# EAGLE design integrator (EAGLE 7.2.0)
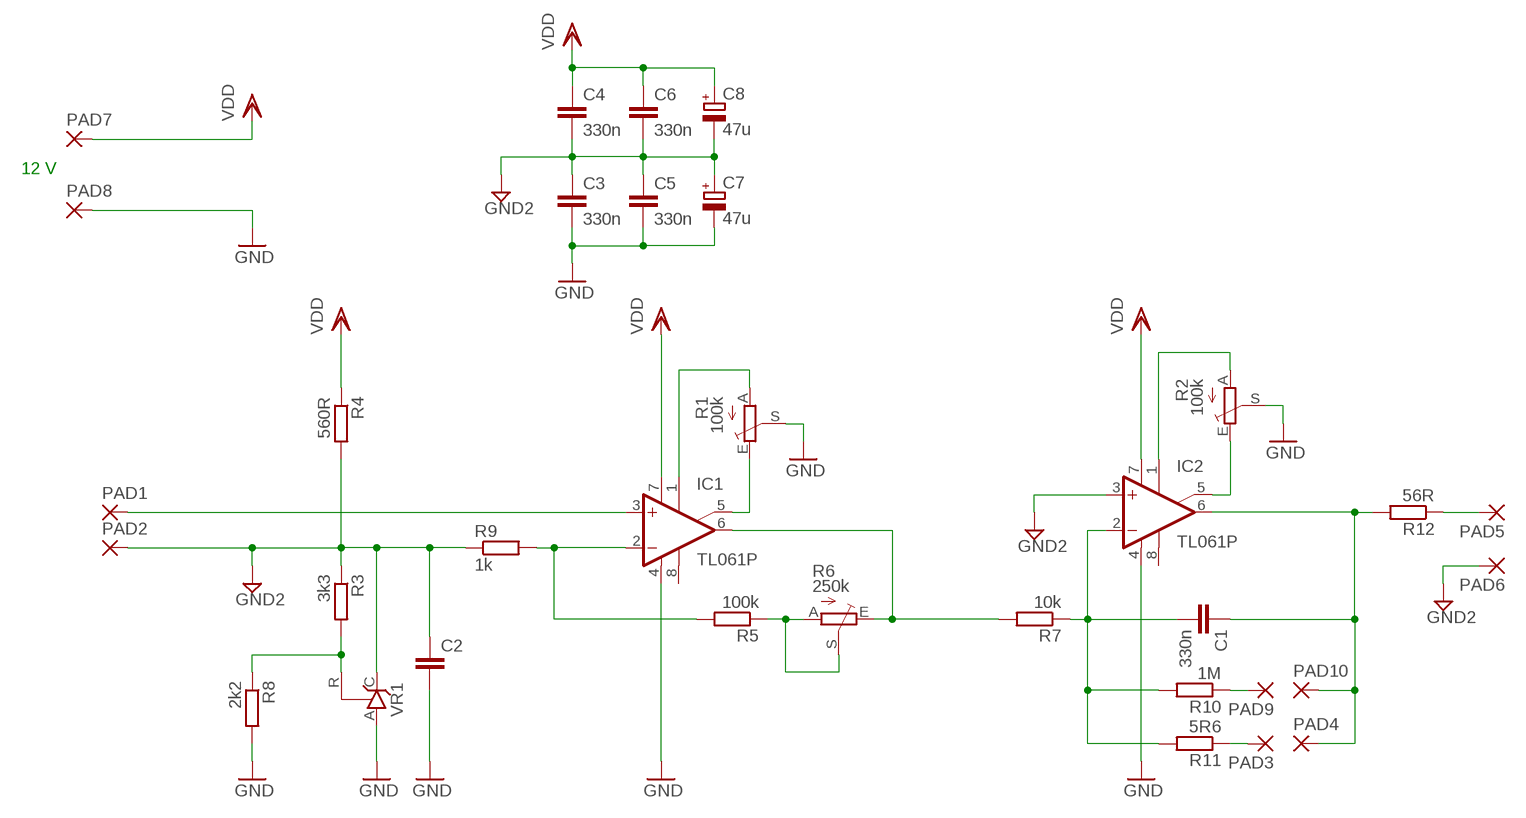
[diagram p0: schematic, sheet 1]

## Parts
C1  330n  C-EU050-035X075  [C050-035X075]
C2  C-EU050-035X075  [C050-035X075]
C3  330n  C-EU050-035X075  [C050-035X075]
C4  330n  C-EU050-035X075  [C050-035X075]
C5  330n  C-EU050-035X075  [C050-035X075]
C6  330n  C-EU050-035X075  [C050-035X075]
C7  47u  CPOL-EUE2.5-7  [E2,5-7]
C8  47u  CPOL-EUE2.5-7  [E2,5-7]
IC1  TL061P  [DIL08]
IC2  TL061P  [DIL08]
PAD1  3,81/1,4  [3,81/1,4]
PAD2  3,81/1,4  [3,81/1,4]
PAD3  3,81/1,4  [3,81/1,4]
PAD4  3,81/1,4  [3,81/1,4]
PAD5  3,81/1,4  [3,81/1,4]
PAD6  3,81/1,4  [3,81/1,4]
PAD7  3,81/1,4  [3,81/1,4]
PAD8  3,81/1,4  [3,81/1,4]
PAD9  3,81/1,4  [3,81/1,4]
PAD10  3,81/1,4  [3,81/1,4]
R1  100k  TRIM_EU-LI10  [LI10]
R2  100k  TRIM_EU-LI10  [LI10]
R3  3k3  R-EU_0207/12  [0207/12]
R4  560R  R-EU_0207/12  [0207/12]
R5  100k  R-EU_0207/12  [0207/12]
R6  250k  TRIM_EU-LI10  [LI10]
R7  10k  R-EU_0207/12  [0207/12]
R8  2k2  R-EU_0207/12  [0207/12]
R9  1k  R-EU_0207/12  [0207/12]
R10  1M  R-EU_0207/12  [0207/12]
R11  5R6  R-EU_0207/12  [0207/12]
R12  56R  R-EU_0207/12  [0207/12]
VR1  TL431CLP  [TO92-CLP]

## Nets
GND: C2.2 C3.2 C5.2 C7.- IC1.4(V-) IC2.4(V-) PAD8.1(P) R1.S R2.S R8.2 VR1.A
GND2: C2.1 C3.1 C4.2 C5.1 C6.2 C7.+ C8.- IC2.3(+IN) PAD2.1(P) PAD6.1(P) R3.1 R4.2 R9.1 VR1.C
N$1: IC1.5(ON2) R1.E
N$2: IC1.1(ON1) R1.A
N$3: IC2.5(ON2) R2.E
N$4: IC2.1(ON1) R2.A
N$5: IC1.2(-IN) R5.2 R9.2
N$6: R5.1 R6.A R6.S
N$7: IC1.6(OUT) R6.E R7.2
N$8: C1.2 IC2.2(-IN) R7.1 R10.2 R11.2
N$10: R3.2 R8.1 VR1.R
N$11: PAD9.1(P) R10.1
N$14: IC1.3(+IN) PAD1.1(P)
N$15: PAD3.1(P) R11.1
N$16: PAD5.1(P) R12.1
OUT: C1.1 IC2.6(OUT) PAD4.1(P) PAD10.1(P) R12.2
VDD: C4.1 C6.1 C8.+ IC1.7(V+) IC2.7(V+) PAD7.1(P) R4.1
Unconnected: IC1.8(OPT) IC2.8(OPT)

## Notes on the sheet
- 12 V

## Library data of the parts
C1-C6 = rcl:C-EU: CAPACITOR, European symbol
C7 C8 = rcl:CPOL-EU: POLARIZED CAPACITOR, European symbol
IC1 IC2 = linear:TL061: OP AMP
PAD1-PAD10 = wirepad:3,81/1,4: THROUGH-HOLE PAD
R1 R2 R6 = pot:TRIM_EU-: POTENTIOMETER
R3-R5 R7-R12 = rcl:R-EU_: RESISTOR, European symbol
VR1 = v-reg:TL431CLP: VOLTAGE REGULATOR

## Board
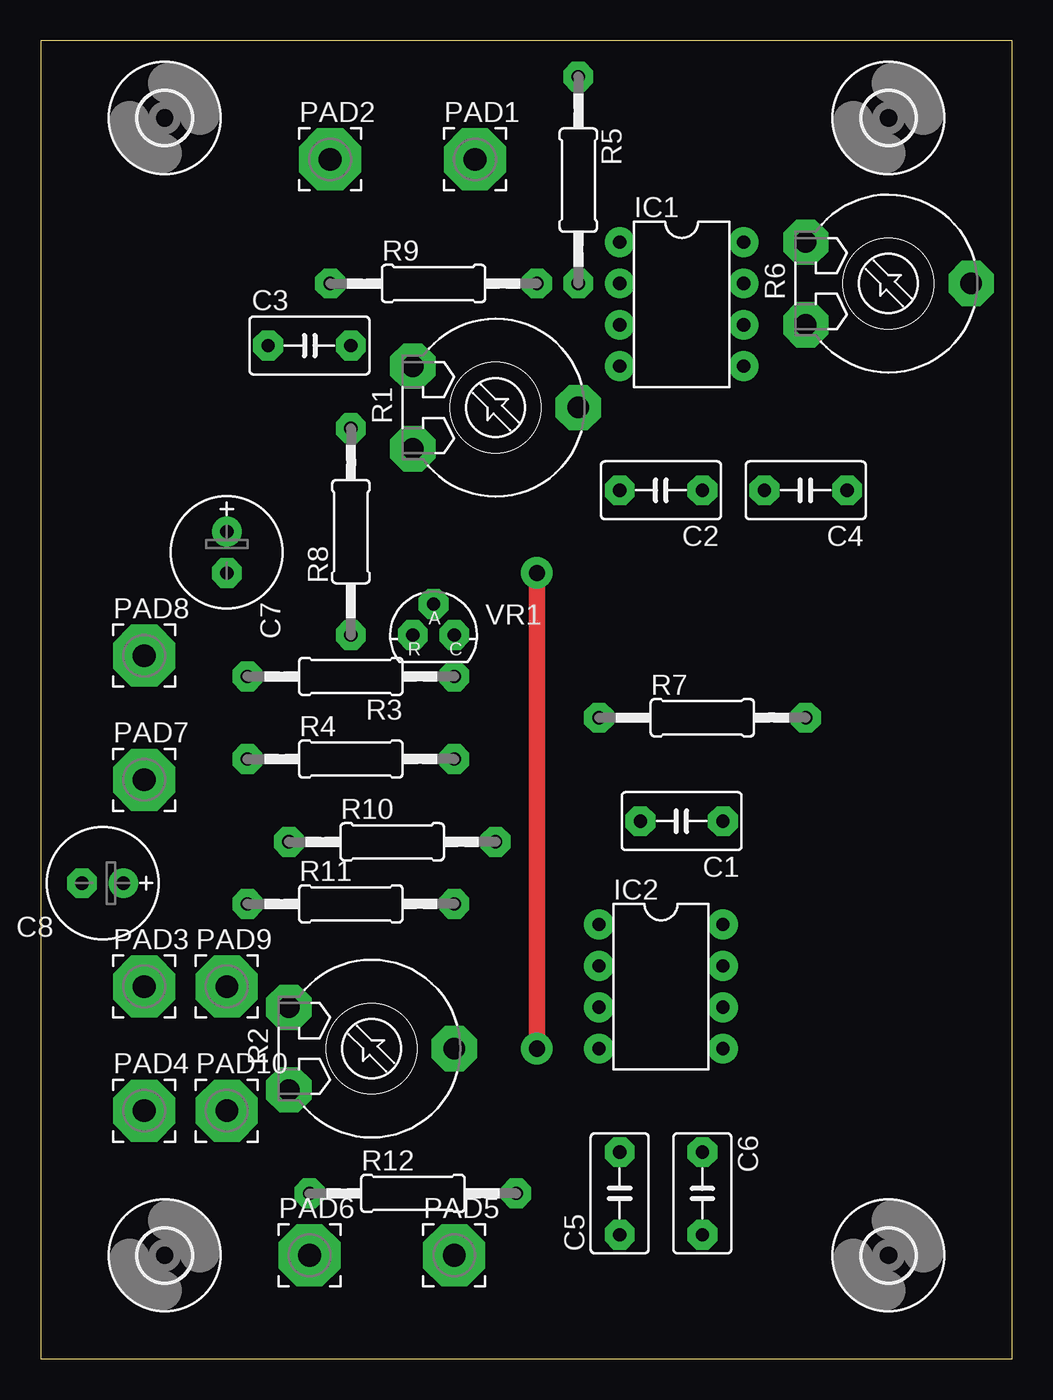
[diagram p1: board, top side]
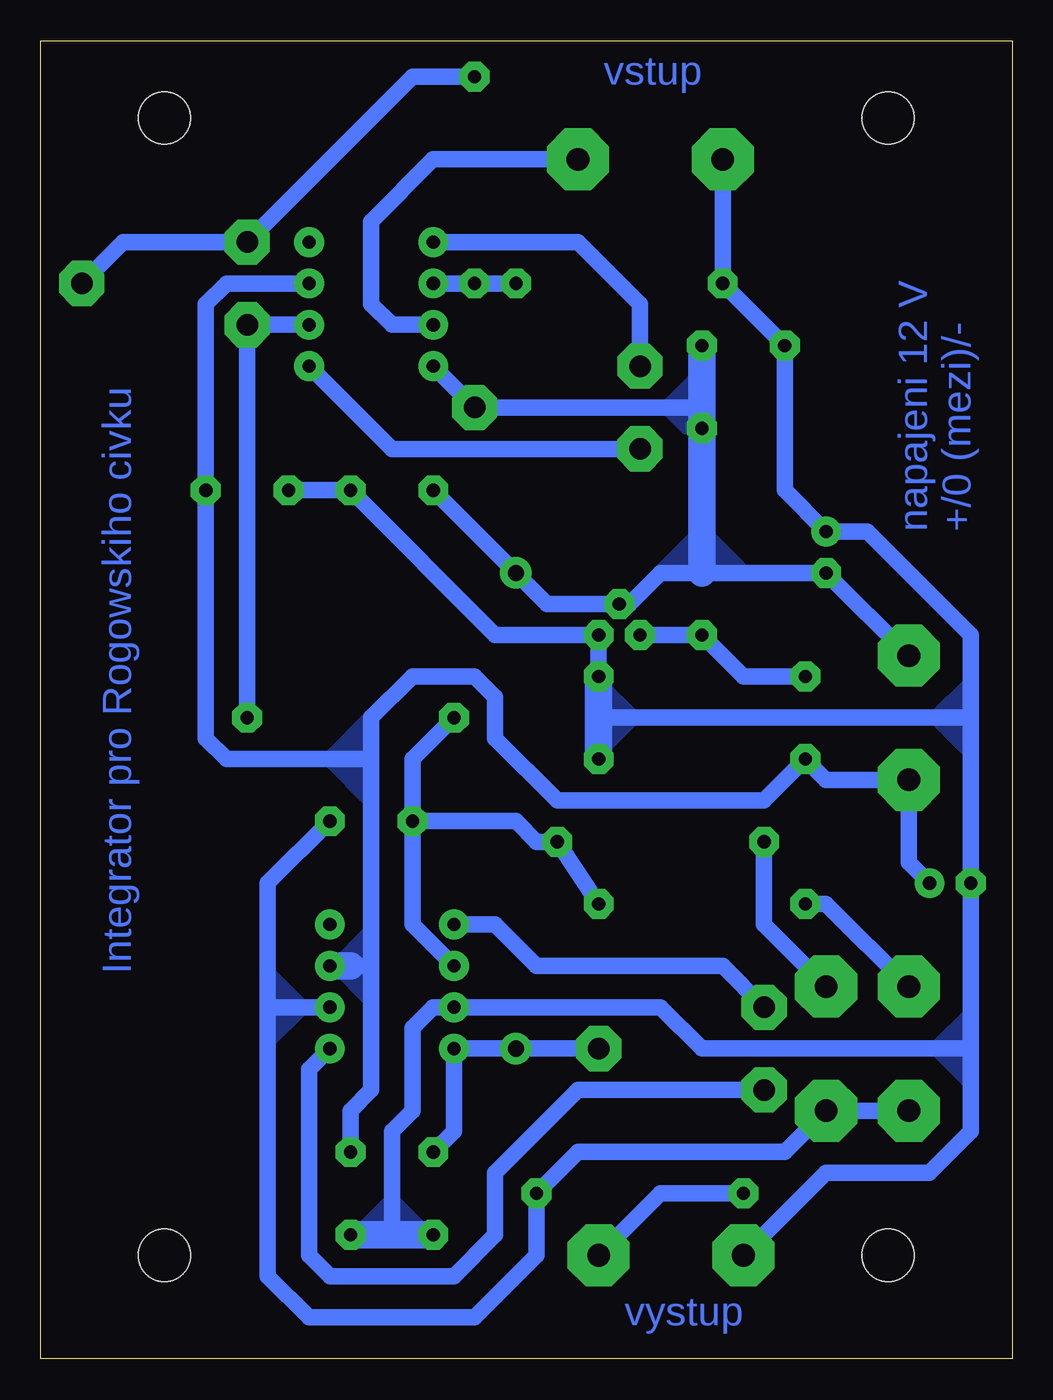
[diagram p2: board, bottom side, seen from below]

Size 59.67 x 80.95 mm. Coordinates in mm from the lower left corner, seen from the top.
Outline: 0,0 59.67,0 59.67,80.95 0,80.95 0,0
Copper layers (1*16): Top 0.035mm / dielectric 1.5mm / Bottom 0.035mm
Design rules "default *": minimum track width 10mil, minimum drill 24mil, track to track 8mil, track to pad 8mil, pad to pad 8mil, via to via 8mil, smd to smd 8mil, copper to edge 40mil, drill to drill 8mil, minimum pad ring 20mil, minimum via ring 8mil, stop-mask expansion 4mil, vias tented up to drill 0mil, thermal gap 0mil

### Footprints (pad centres in the part's own frame; a part is rotated, then mirrored left to right if it is on the bottom)
C050-035X075 = drill 0.813 octagon: 1 -2.54,0; 2 2.54,0
E2,5-7 = drill 0.813 pad 1.6: + -1.27,0 | drill 0.813 pad 1.6 octagon: - 1.27,0
DIL08 = drill 0.813 pad 1.27: 1 -3.81,-3.81; 2 -1.27,-3.81; 3 1.27,-3.81; 4 3.81,-3.81; 5 3.81,3.81; 6 1.27,3.81; 7 -1.27,3.81; 8 -3.81,3.81
3,81/1,4 = drill 1.397 pad 3.81 octagon: 1 0,0
LI10 = drill 1.321 octagon: A -2.54,-5.08; E 2.54,-5.08; S 0,5.08
0207/12 = drill 0.813 octagon: 1 -6.35,0; 2 6.35,0
3,2 = hole 3.2: 0,0
TO92-CLP = drill 0.813 octagon: A 0,1.905; C 1.27,0; R -1.27,0

### Placement (x,y rotation side)
C1  39.37,33.02 180 top
C2  38.1,53.34 180 top
C3  16.51,62.23 0 top
C4  46.99,53.34 180 top
C5  35.56,10.16 90 top
C6  40.64,10.16 270 top
C7  11.43,49.53 270 top
C8  3.81,29.21 180 top
IC1  39.37,64.77 270 top
IC2  38.1,22.86 270 top
PAD1  26.67,73.66 0 top
PAD2  17.78,73.66 0 top
PAD3  6.35,22.86 0 top
PAD4  6.35,15.24 0 top
PAD5  25.4,6.35 0 top
PAD6  16.51,6.35 0 top
PAD7  6.35,35.56 0 top
PAD8  6.35,43.18 0 top
PAD9  11.43,22.86 0 top
PAD10  11.43,15.24 0 top
R1  27.94,58.42 270 top
R2  20.32,19.05 270 top
R3  19.05,41.91 180 top
R4  19.05,36.83 0 top
R5  33.02,72.39 270 top
R6  52.07,66.04 270 top
R7  40.64,39.37 0 top
R8  19.05,50.8 90 top
R9  24.13,66.04 0 top
R10  21.59,31.75 0 top
R11  19.05,27.94 0 top
R12  22.86,10.16 0 top
U$1  [3,2]  7.62,6.35 0 top
U$2  [3,2]  52.07,6.35 0 top
U$3  [3,2]  52.07,76.2 0 top
U$4  [3,2]  7.62,76.2 0 top
VR1  24.13,44.45 0 top

### Tracks (layer width: path | path; a pad name or v marks a point on that pad's centre or on a via)
GND  (via drill 1 pad 1.93)
  Top 1.016: v30.48,48.26 v30.48,19.05
  Bottom 1.016: 19.05,58.42 R1.S IC1.4 | C5.2 34.29,13.97 IC2.4 v30.48,19.05 R2.S | C2.2 v30.48,48.26 28.57,46.35 VR1.A 23.5,46.35 21.59,48.26 19.05,48.26 C7.- PAD8.1
  Bottom 1.676: C3.2 19.05,58.42 R8.2 19.05,48.26
  pour Bottom: 16.51,48.26 19.05,50.8 21.59,48.26
  pour Bottom: 19.05,60.96 21.59,58.42 19.05,55.88
GND2
  Bottom 1.016: PAD2.1 R9.1 C3.1 13.97,53.34 C7.+ 8.89,50.8 2.54,44.45 2.54,39.37 | R3.1 VR1.C 31.75,44.45 C2.1 C4.2 | 25.4,39.37 2.54,39.37 | 2.54,19.05 19.05,19.05 21.59,21.59 IC2.3 35.56,21.59 36.83,20.32 36.83,15.24 38.1,13.97 38.1,7.62 | PAD6.1 11.43,11.43 5.08,11.43 2.54,13.97 2.54,19.05 | 2.54,39.37 C8.- 2.54,19.05
  Bottom 1.676: R3.1 25.4,39.37 R4.2 | C5.1 38.1,7.62 C6.2
  pour Bottom: 2.54,39.37 2.54,41.91 5.08,39.37 2.54,36.83
  pour Bottom: 25.4,39.37 25.4,41.91 22.86,39.37 25.4,36.83
  pour Bottom: 2.54,16.51 2.54,21.59 5.08,19.05
  pour Bottom: 35.56,7.62 38.1,10.16 40.64,7.62
N$1
  Bottom 1.016: R1.E 38.1,55.88 IC1.5
N$2
  Bottom 1.016: R1.A 22.86,64.77 26.67,68.58 IC1.1
N$3
  Bottom 1.016: R2.E 26.67,16.51 31.75,11.43 31.75,7.62 34.29,5.08 41.91,5.08 43.18,6.35 43.18,17.78 IC2.5
N$4
  Bottom 1.016: R2.A 17.78,24.13 29.21,24.13 31.75,26.67 IC2.1
N$5
  Bottom 1.016: R9.2 R5.2 IC1.2
N$6
  Bottom 1.016: R5.1 36.83,78.74 R6.A 54.61,68.58 R6.S
N$7
  Bottom 1.016: IC1.6 R6.E R7.2
N$8
  Bottom 1.016: C1.2 36.83,36.83 R7.1 | C1.2 36.83,26.67 IC2.2 | C1.2 30.48,33.02 29.21,31.75 R10.2 R11.2
N$10
  Bottom 1.016: VR1.R R8.1 16.51,41.91 R3.2
N$11
  Bottom 1.016: PAD9.1 15.24,26.67 R10.1
N$14
  Bottom 1.016: PAD1.1 35.56,73.66 39.37,69.85 39.37,64.77 38.1,63.5 IC1.3
N$15
  Bottom 1.016: PAD3.1 11.43,27.94 R11.1
N$16
  Bottom 1.016: R12.1 21.59,10.16 PAD5.1
OUT
  Bottom 1.016: PAD4.1 PAD10.1 13.97,12.7 26.67,12.7 R12.2 29.21,6.35 33.02,2.54 43.18,2.54 45.72,5.08 45.72,21.59 | 45.72,21.59 45.72,29.21 C1.1 | IC2.6 45.72,21.59
  pour Bottom: 45.72,19.05 43.18,21.59 45.72,24.13
VDD
  Bottom 1.016: IC1.7 48.26,66.04 49.53,64.77 C4.1 49.53,38.1 48.26,36.83 39.37,36.83 | 39.37,36.83 39.37,39.37 36.83,41.91 33.02,41.91 31.75,40.64 31.75,38.1 27.94,34.29 15.24,34.29 R4.1 11.43,35.56 PAD7.1 6.35,30.48 C8.+ | C6.1 40.64,15.24 39.37,16.51 39.37,24.13 | 39.37,24.13 39.37,36.83 | 40.64,24.13 39.37,24.13
  Bottom 1.676: IC2.7 40.64,24.13
  pour Bottom: 39.37,34.29 39.37,39.37 41.91,36.83
  pour Bottom: 39.37,21.59 41.91,24.13 39.37,26.67

### Text on the board
Bottom: vstup | Integrator pro Rogowskiho civku | napajeni 12 V / +/0 (mezi)/- | vystup